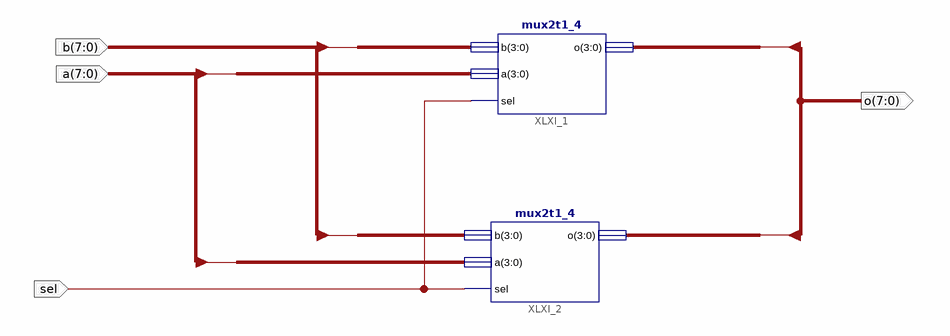
[diagram p0: schematic sheet 1]
// Xilinx ISE schematic mux2t1_8.sch (kintex7) as structural Verilog: 2 symbols, 4 ports
module mux2t1_8 (
  input  [7:0] b,
  input  [7:0] a,
  input  sel,
  output [7:0] o
);

  mux2t1_4 XLXI_1 (.b(b[3:0]), .a(a[3:0]), .sel(sel), .o(o[3:0]));
  mux2t1_4 XLXI_2 (.b(b[7:4]), .a(a[7:4]), .sel(sel), .o(o[7:4]));
endmodule
